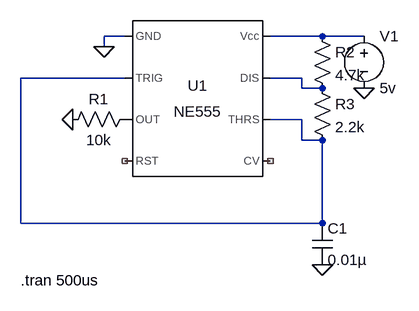
[diagram p0: schematic Astable.asc]
Astable.asc, the LTspice schematic file:
Version 4
SHEET 1 880 680
WIRE 112 80 80 80
WIRE 416 80 336 80
WIRE 480 80 416 80
WIRE 80 96 80 80
WIRE 112 144 -48 144
WIRE 384 144 336 144
WIRE 384 160 384 144
WIRE 416 160 384 160
WIRE 384 208 336 208
WIRE 384 240 384 208
WIRE 416 240 384 240
WIRE -48 368 -48 144
WIRE 416 368 416 240
WIRE 416 368 -48 368
FLAG 32 208 0
FLAG 480 160 0
FLAG 416 432 0
FLAG 80 96 0
SYMBOL Misc\\NE555 224 176 R0
SYMATTR InstName U1
SYMBOL res 128 192 R90
WINDOW 0 0 56 VBottom 2
WINDOW 3 32 56 VTop 2
SYMATTR InstName R1
SYMATTR Value 10k
SYMBOL voltage 480 64 R0
WINDOW 123 0 0 Left 0
WINDOW 39 0 0 Left 0
SYMATTR InstName V1
SYMATTR Value 5v
SYMBOL res 400 64 R0
SYMATTR InstName R2
SYMATTR Value 4.7k
SYMBOL res 400 144 R0
SYMATTR InstName R3
SYMATTR Value 2.2k
SYMBOL cap 400 368 R0
SYMATTR InstName C1
SYMATTR Value 0.01µ
TEXT -48 456 Left 2 !.tran 500us

The netlist it stands for:
* Astable.asc
XU1 0 N002 P001 NC_01 NC_02 N002 N003 N001 NE555  ; pins GND TRIG OUT RST CV THRS DIS Vcc
R1 P001 0 10k
V1 N001 0 5v
R2 N001 N003 4.7k
R3 N003 N002 2.2k
C1 N002 0 0.01µ
.tran 500us
.lib NE555.sub
.backanno
.end